# EAGLE design env_sensor_3 (EAGLE 9.7.0)
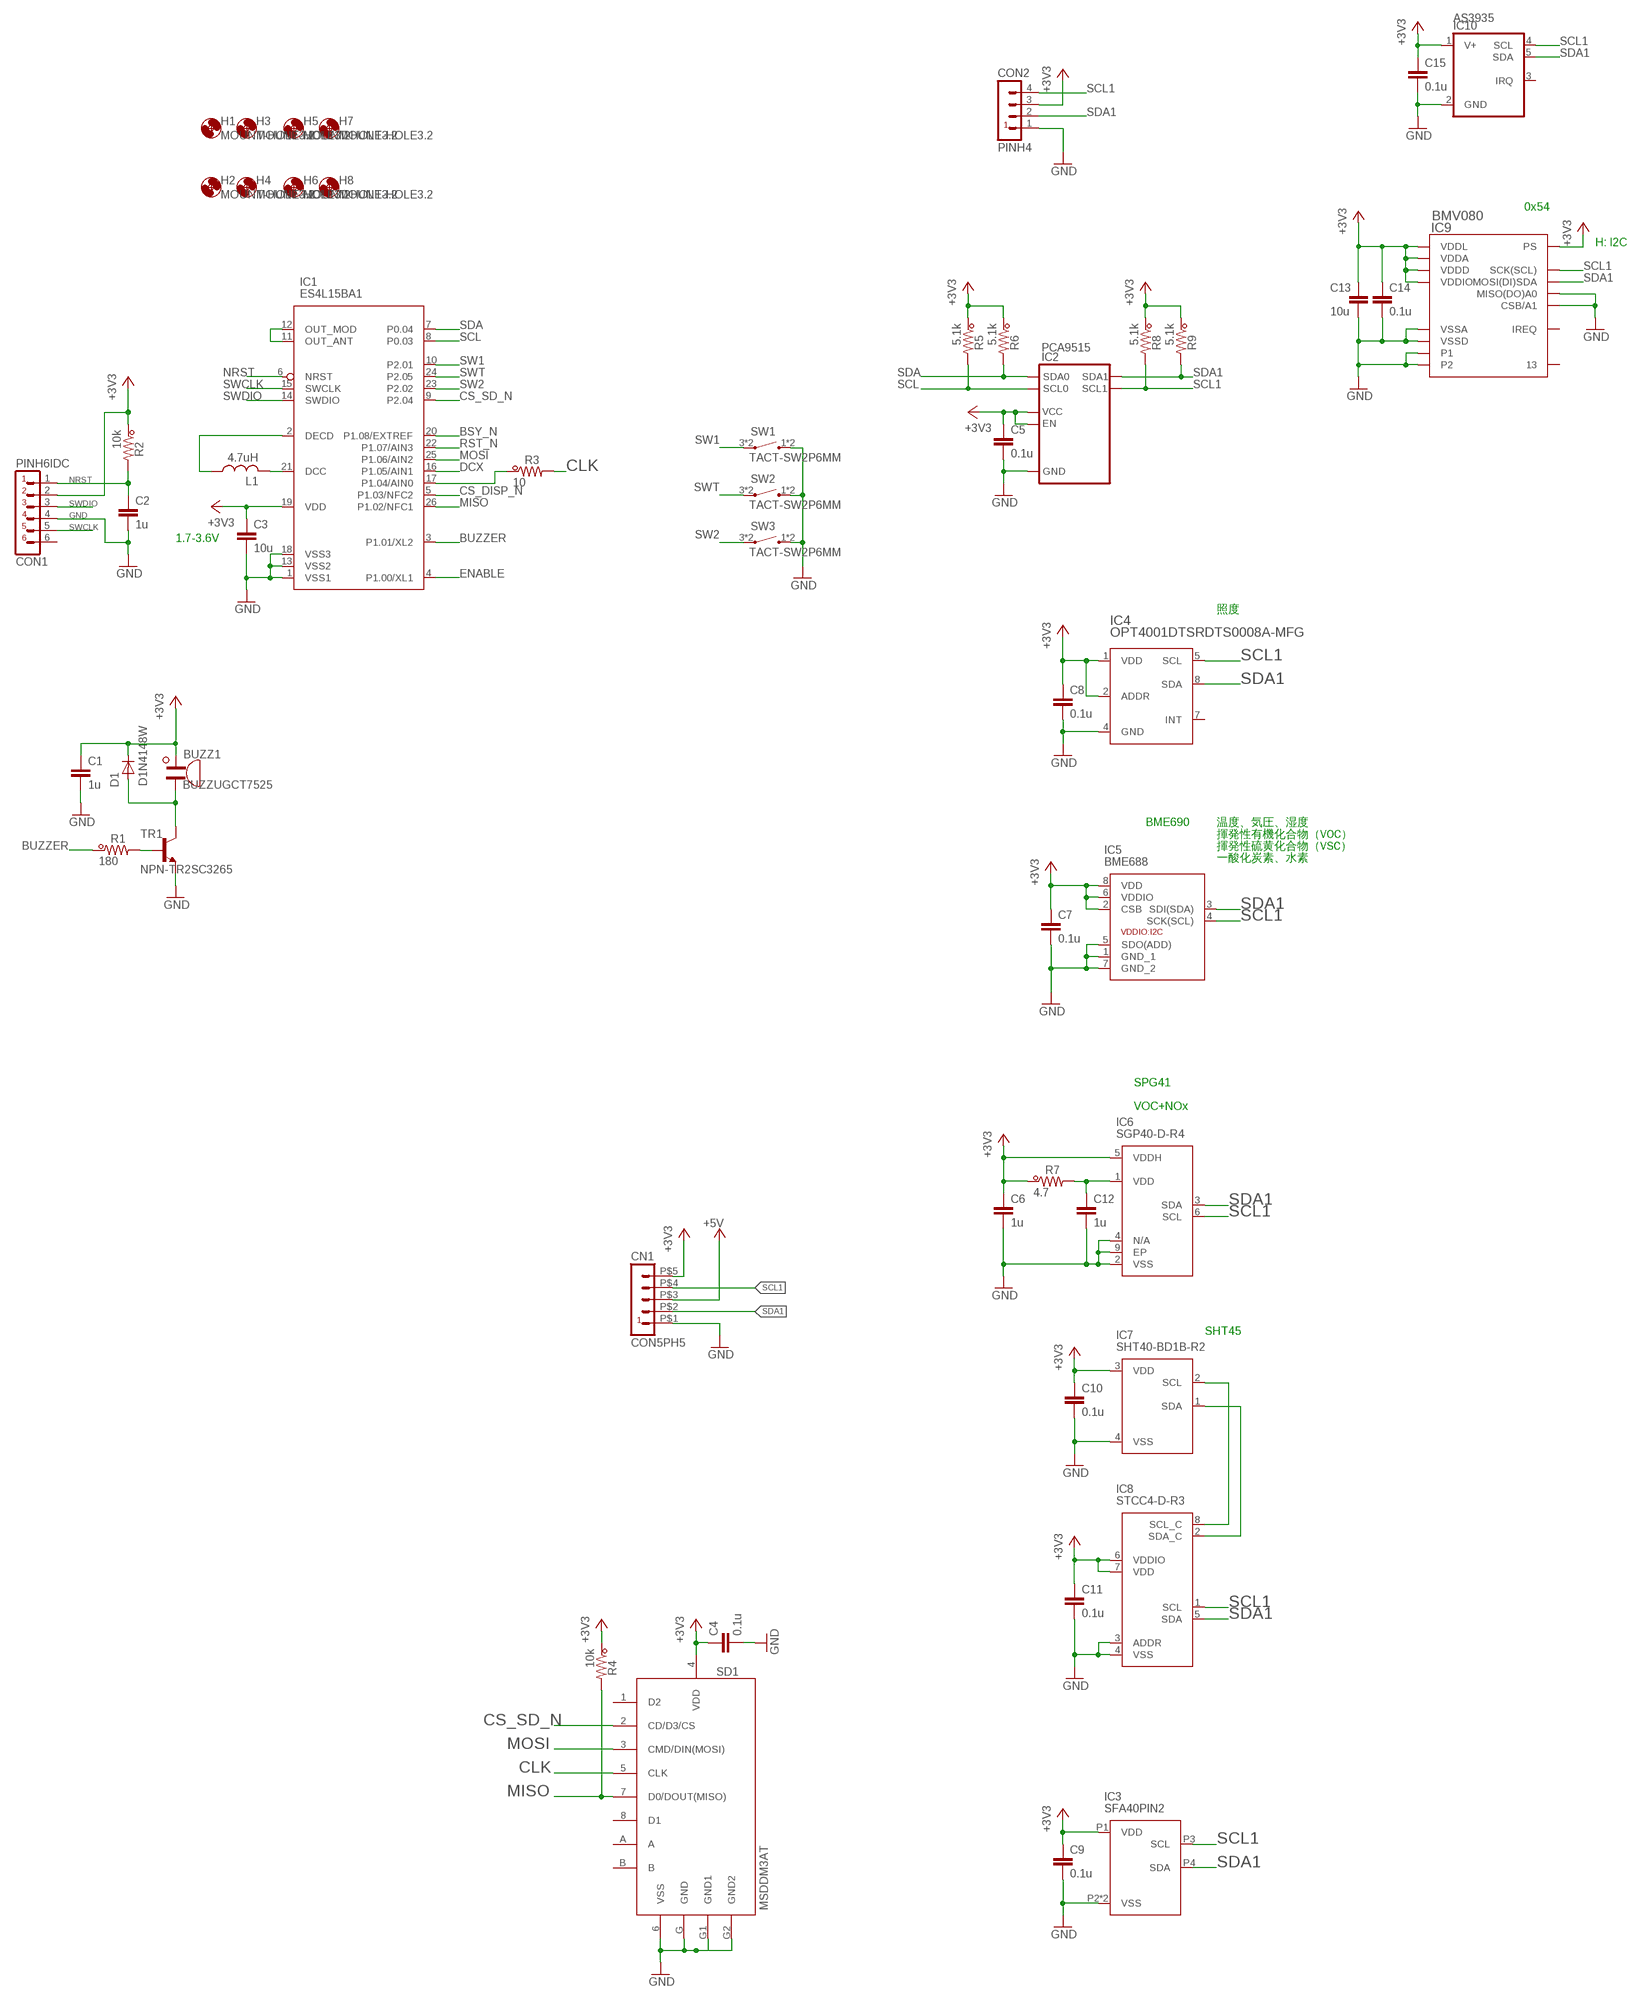
[diagram p0: schematic, sheet 1, part 1 of 2]
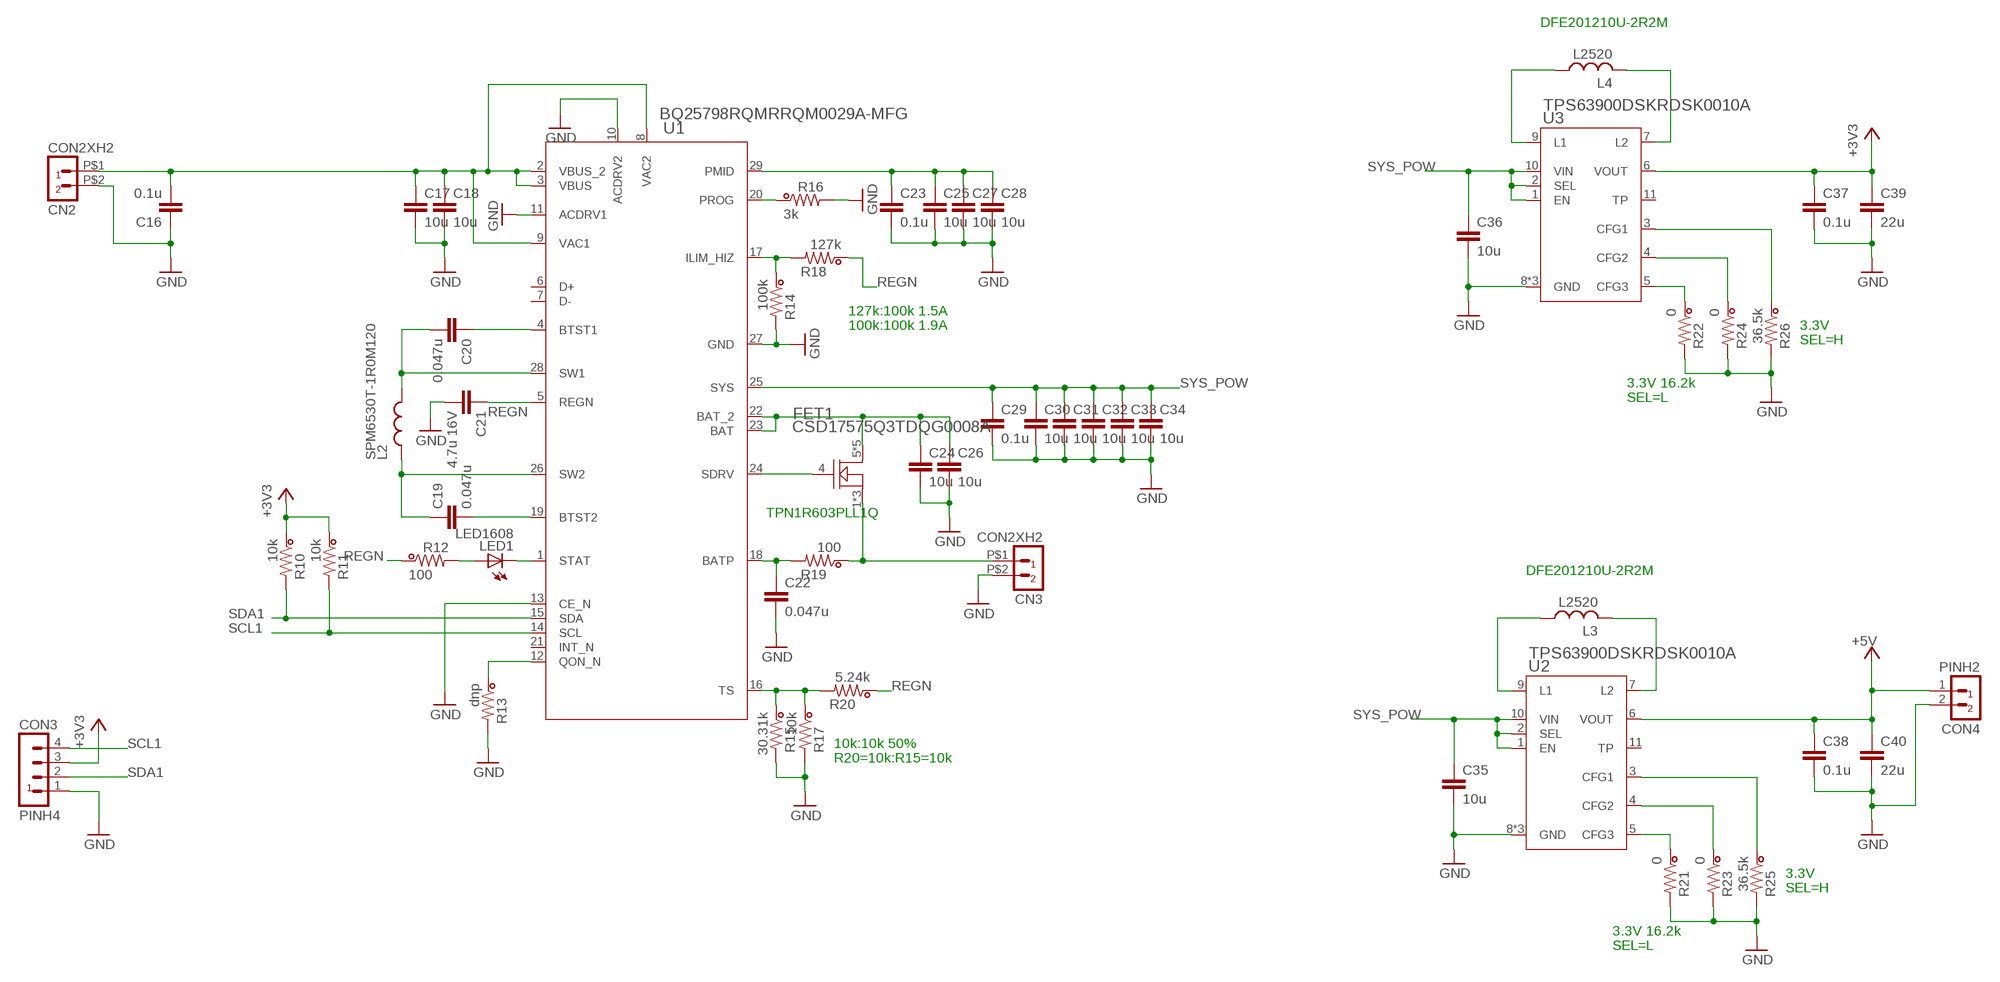
[diagram p1: schematic, sheet 1, part 2 of 2]

## Parts
BUZZ1  BUZZUGCT7525  [UGCT7525]
C1  1u  C-CC1005A  [1005A]
C2  1u  C-CC1005A  [1005A]
C3  10u  C-CC1608A  [1608A]
C4  0.1u  C-CC1005A  [1005A]
C5  0.1u  C-CC1005K  [1005K]
C6  1u  C-CC1005K  [1005K]
C7  0.1u  C-CC1005K  [1005K]
C8  0.1u  C-CC1005K  [1005K]
C9  0.1u  C-CC1005K  [1005K]
C10  0.1u  C-CC1005K  [1005K]
C11  0.1u  C-CC1005K  [1005K]
C12  1u  C-CC1005K  [1005K]
C13  10u  C-CC1005K  [1005K]
C14  0.1u  C-CC1005K  [1005K]
C15  0.1u  C-CC1005K  [1005K]
C16  0.1u  C-CC1005K  [1005K]
C17  10u  C-CC2012A  [2012A]
C18  10u  C-CC2012A  [2012A]
C19  0.047u  C-CC1005K  [1005K]
C20  0.047u  C-CC1005K  [1005K]
C21  4.7u 16V  C-CC1608A  [1608A]
C22  0.047u  C-CC1005K  [1005K]
C23  0.1u  C-CC1005A  [1005A]
C24  10u  C-CC2012A  [2012A]
C25  10u  C-CC2012A  [2012A]
C26  10u  C-CC2012A  [2012A]
C27  10u  C-CC2012A  [2012A]
C28  10u  C-CC2012A  [2012A]
C29  0.1u  C-CC1005A  [1005A]
C30  10u  C-CC2012A  [2012A]
C31  10u  C-CC2012A  [2012A]
C32  10u  C-CC2012A  [2012A]
C33  10u  C-CC2012A  [2012A]
C34  10u  C-CC2012A  [2012A]
C35  10u  C-CC2012A  [2012A]
C36  10u  C-CC2012A  [2012A]
C37  0.1u  C-CC1005A  [1005A]
C38  0.1u  C-CC1005A  [1005A]
C39  22u  C-CC2012A  [2012A]
C40  22u  C-CC2012A  [2012A]
CN1  CON5PH5  [PH5]
CN2  CON2XH2  [XH2]
CN3  CON2XH2  [XH2]
CON1  PINH6IDC  [1X6IDC_1R27]
CON2  PINH4  [PINH4]
CON3  PINH4  [PINH4]
CON4  PINH2  [PINH2]
D1  D1N4148W  [1N4148W]
FET1  CSD17575Q3TDQG0008A  [DQG0008A]
H1  MOUNT-HOLE3.2  [3,2]
H2  MOUNT-HOLE3.2  [3,2]
H3  MOUNT-HOLE3.2  [3,2]
H4  MOUNT-HOLE3.2  [3,2]
H5  MOUNT-HOLE3.2  [3,2]
H6  MOUNT-HOLE3.2  [3,2]
H7  MOUNT-HOLE3.2  [3,2]
H8  MOUNT-HOLE3.2  [3,2]
IC1  ES4L15BA1  [ES4L15BA1]
IC2  PCA9515  [SO8]
IC3  SFA40PIN2  [SFA40-PIN2]
IC4  OPT4001DTSRDTS0008A-MFG  [DTS0008A-MFG]
IC5  BME688  [BME688]
IC6  SGP40-D-R4  [SON80P244X244X95-7N]
IC7  SHT40-BD1B-R2  [SHT40BD1BR2]
IC8  STCC4-D-R3  [STCC4DR3]
IC9  BMV080  [CON_5035661302_MOL]
IC10  AS3935  [AS3935]
L1  4.7uH  L1608  [1608A]
L2  SPM6530T-1R0M120  [IND_SPM6530T-1R0M120]
L3  L2520  [2520]
L4  L2520  [2520]
LED1  LED1608  [LED1608]
R1  180  R-CC1005A  [1005A]
R2  10k  R-CC1005A  [1005A]
R3  10  R-CC1005A  [1005A]
R4  10k  R-CC1005A  [1005A]
R5  5.1k  R-CC1005A  [1005A]
R6  5.1k  R-CC1005A  [1005A]
R7  4.7  R-CC1005A  [1005A]
R8  5.1k  R-CC1005A  [1005A]
R9  5.1k  R-CC1005A  [1005A]
R10  10k  R-CC1005A  [1005A]
R11  10k  R-CC1005A  [1005A]
R12  100  R-CC1005A  [1005A]
R13  dnp  R-CC1608A  [1608A]
R14  100k  R-CC1005A  [1005A]
R15  30.31k  R-CC1005A  [1005A]
R16  3k  R-CC1005A  [1005A]
R17  10k  R-CC2012A  [2012A]
R18  127k  R-CC1005A  [1005A]
R19  100  R-CC1005A  [1005A]
R20  5.24k  R-CC1005A  [1005A]
R21  0  R-CC1005A  [1005A]
R22  0  R-CC1005A  [1005A]
R23  0  R-CC1005A  [1005A]
R24  0  R-CC1005A  [1005A]
R25  36.5k  R-CC1005A  [1005A]
R26  36.5k  R-CC1005A  [1005A]
SD1  MSDDM3AT  [DM3AT]
SW1  TACT-SW2P6MM  [DTS-6-V]
SW2  TACT-SW2P6MM  [DTS-6-V]
SW3  TACT-SW2P6MM  [DTS-6-V]
TR1  NPN-TR2SC3265  [SOT23-3]
U1  BQ25798RQMRRQM0029A-MFG  [RQM0029A-MFG]
U2  TPS63900DSKRDSK0010A  [DSK0010A]
U3  TPS63900DSKRDSK0010A  [DSK0010A]

## Nets
+3V3: BUZZ1.P(+) C1.1 C3.1 C4.1 C5.1 C6.1 C7.1 C8.1 C9.1 C10.1 C11.1 C13.1 C14.1 C15.1 C37.1 C39.1 CN1.P$5 CON1.2 CON2.3 CON3.3 D1.C IC1.19(VDD) IC2.5(EN) IC2.8(VCC) IC3.P1(VDD) IC4.1(VDD) IC4.2(ADDR) IC5.2(CSB) IC5.6(VDDIO) IC5.8(VDD) IC6.5(VDDH) IC7.3(VDD) IC8.6(VDDIO) IC8.7(VDD) IC9.1(VDDL) IC9.3(VDDA) IC9.7(PS) IC9.8(VDDIO) IC9.10(VDDD) IC10.1(V+) R2.1 R4.1 R5.1 R6.1 R7.1 R8.1 R9.1 R10.1 R11.1 SD1.4(VDD) U3.6(VOUT)
+5V: C38.1 C40.1 CN1.P$3 CON4.1 U2.6(VOUT)
BSY_N: IC1.20(P1.08/EXTREF)
BUZZER: IC1.3(P1.01/XL2) R1.1
CLK: R3.2 SD1.5(CLK)
CS_DISP_N: IC1.5(P1.03/NFC2)
CS_SD_N: IC1.9(P2.04) SD1.2(CD/D3/CS)
DCX: IC1.16(P1.05/AIN1)
ENABLE: IC1.4(P1.00/XL1)
GND: C1.2 C2.2 C3.2 C4.2 C5.2 C6.2 C7.2 C8.2 C9.2 C10.2 C11.2 C12.2 C13.2 C14.2 C15.2 C16.1 C17.2 C18.2 C21.2 C22.2 C23.2 C24.2 C25.2 C26.2 C27.2 C28.2 C29.2 C30.2 C31.2 C32.2 C33.2 C34.2 C35.2 C36.2 C37.2 C38.2 C39.2 C40.2 CN1.P$1 CN2.P$2 CN3.P$2 CON1.4 CON2.1 CON3.1 CON4.2 IC1.1(VSS1) IC1.13(VSS2) IC1.18(VSS3) IC2.4(GND) IC3.P2(VSS) IC3.P6(VSS) IC4.4(GND) IC5.1(GND_1) IC5.5(SDO(ADD)) IC5.7(GND_2) IC6.2(VSS) IC6.4(N/A) IC6.9(EP) IC7.4(VSS) IC8.3(ADDR) IC8.4(VSS) IC9.2(VSSA) IC9.4(CSB/A1) IC9.9(VSSD) IC9.11(MISO(DO)A0) IC9.P1 IC9.P2 IC10.2(GND) R13.2 R14.2 R15.2 R16.2 R17.2 R21.2 R22.2 R23.2 R24.2 R25.2 R26.2 SD1.6(VSS) SD1.G1(GND1) SD1.G2(GND2) SD1.G(GND) SW1.1(T1) SW1.2(T1) SW2.1(T1) SW2.2(T1) SW3.1(T1) SW3.2(T1) TR1.2(E) U1.10(ACDRV2) U1.11(ACDRV1) U1.13(CE_N) U1.27(GND) U2.8(GND) U2.V(GND) U2.V_1(GND) U3.8(GND) U3.V(GND) U3.V_1(GND)
MISO: IC1.26(P1.02/NFC1) R4.2 SD1.7(D0/DOUT(MISO))
MOSI: IC1.25(P1.06/AIN2) SD1.3(CMD/DIN(MOSI))
N$1: IC1.17(P1.04/AIN0) R3.1
N$2: R1.2 TR1.1(B)
N$3: R25.1 U2.3(CFG1)
N$4: R26.1 U3.3(CFG1)
N$5: R13.1 U1.12(QON_N)
N$6: R16.1 U1.20(PROG)
N$7: L4.2 U3.7(L2)
N$8: L4.1 U3.9(L1)
N$9: L3.2 U2.7(L2)
N$10: LED1.K(C) U1.1(STAT)
N$11: C20.2 L2.2 U1.28(SW1)
N$12: C19.1 L2.1 U1.26(SW2)
N$13: BUZZ1.N(-) D1.A TR1.3(C)
N$14: C20.1 U1.4(BTST1)
N$15: C19.2 U1.19(BTST2)
N$16: C23.1 C25.1 C27.1 C28.1 U1.29(PMID)
N$17: R14.1 R18.2 U1.17(ILIM_HIZ)
N$18: FET1.4(G) U1.24(SDRV)
N$19: C24.1 C26.1 FET1.5(D) FET1.6(D) FET1.7(D) FET1.8(D) FET1.9(D) U1.22(BAT_2) U1.23(BAT)
N$20: C22.1 R19.2 U1.18(BATP)
N$21: CN3.P$1 FET1.1(S) FET1.2(S) FET1.3(S) R19.1
N$22: R15.1 R17.1 R20.2 U1.16(TS)
N$23: LED1.A R12.2
N$24: R24.1 U3.4(CFG2)
N$25: R22.1 U3.5(CFG3)
N$26: C16.2 C17.1 C18.1 CN2.P$1 U1.2(VBUS_2) U1.3(VBUS) U1.8(VAC2) U1.9(VAC1)
N$27: L3.1 U2.9(L1)
N$28: C12.1 IC6.1(VDD) R7.2
N$29: R23.1 U2.4(CFG2)
N$30: R21.1 U2.5(CFG3)
N$51: IC1.21(DCC) L1.2
N$53: IC7.2(SCL) IC8.8(SCL_C)
N$55: IC7.1(SDA) IC8.2(SDA_C)
N$61: IC1.2(DECD) L1.1
N$63: IC1.11(OUT_ANT) IC1.12(OUT_MOD)
NRST: C2.1 CON1.1 IC1.6(NRST) R2.2
REGN: C21.1 R12.1 R18.1 R20.1 U1.5(REGN)
RST_N: IC1.22(P1.07/AIN3)
SCL: IC1.8(P0.03) IC2.2(SCL0) R5.2
SCL1: CN1.P$4 CON2.4 CON3.4 IC2.7(SCL1) IC3.P3(SCL) IC4.5(SCL) IC5.4(SCK(SCL)) IC6.6(SCL) IC8.1(SCL) IC9.6(SCK(SCL)) IC10.4(SCL) R8.2 R11.2 U1.14(SCL)
SDA: IC1.7(P0.04) IC2.3(SDA0) R6.2
SDA1: CN1.P$2 CON2.2 CON3.2 IC2.6(SDA1) IC3.P4(SDA) IC4.8(SDA) IC5.3(SDI(SDA)) IC6.3(SDA) IC8.5(SDA) IC9.5(MOSI(DI)SDA) IC10.5(SDA) R9.2 R10.2 U1.15(SDA)
SW1: IC1.10(P2.01) SW1.3(T2) SW1.4(T2)
SW2: IC1.23(P2.02) SW3.3(T2) SW3.4(T2)
SWCLK: CON1.5 IC1.15(SWCLK)
SWDIO: CON1.3 IC1.14(SWDIO)
SWT: IC1.24(P2.05) SW2.3(T2) SW2.4(T2)
SYS_POW: C29.1 C30.1 C31.1 C32.1 C33.1 C34.1 C35.1 C36.1 U1.25(SYS) U2.1(EN) U2.2(SEL) U2.10(VIN) U3.1(EN) U3.2(SEL) U3.10(VIN)
Unconnected: CON1.6 IC4.7(INT) IC9.12(IREQ) IC9.13 IC10.3(IRQ) SD1.1(D2) SD1.8(D1) SD1.A SD1.B U1.6(D+) U1.7(D-) U1.21(INT_N) U2.11(TP) U3.11(TP)

## Notes on the sheet
- 0x54
- H: I2C
- 1.7-3.6V
- 照度
- DFE201210U-2R2M
- BME690 | 温度、気圧、湿度
- 揮発性有機化合物（VOC）
- 揮発性硫黄化合物（VSC）
- 一酸化炭素、水素
- 127k:100k 1.5A
- 100k:100k 1.9A | 3.3V
- SEL=H
- SPG41 | 3.3V 16.2k
- SEL=L
- VOC+NOx
- TPN1R603PLL1Q
- DFE201210U-2R2M
- SHT45
- 10k:10k 50%
- R20=10k:R15=10k
- 3.3V
- SEL=H
- 3.3V 16.2k
- SEL=L

## Library data of the parts
BUZZ1 = dac:BUZZ; SHOP: AKI
C1-C40 = dac:C-CC
CN1 = dac:CON5
CN2 CN3 = dac:CON2
CON1 = dac:PINH6
CON2 CON3 = dac:PINH4
CON4 = dac:PINH2
D1 = dac:D
FET1 = SamacSys_Parts:CSD17575Q3T; PARTS: TPN1R603PLL1Q; SHOP: aki
H1-H8 = holes:MOUNT-HOLE: MOUNTING HOLE with drill center marker
IC1 = SamacSys_Parts:ES4L15BA1: Board Mount Motion & Position Sensors 9-axis IMU Source: Datasheet <https://www.ceva-dsp.com/wp-content/uploads/2019/10/BNO080_085-Datasheet.pdf>
IC2 = dac:PCA9515; SHOP: AKI
IC3 = SamacSys_Parts:SFA40
IC4 = SamacSys_Parts:OPT4001DTSR
IC5 = SamacSys_Parts:BME688: Gas sensor measuring relative humidity, barometric pressure, ambient temperature and gas (VOC) Source: Datasheet <https://www.bosch-sensortec.com/media/boschsensortec/downloads/datasheets/bst-bme688-ds000.pdf>; PARTS: bme690
IC6 = SamacSys_Parts:SGP40-D-R4: Air Quality Sensors Gas Sensor 2.5k pcs IC Source: Datasheet; PARTS: spg41
IC7 = SamacSys_Parts:SHT40-BD1B-R2: SENSIRION - SHT40-BD1B-R2 - Humidity and Temperature Sensor, Digital, 0% to 100% RH, I2C, DFN-EP-4, -40C to 125C Source: Datasheet <https://sensirion.com/media/documents/33FD6951/63E1087C/Datasheet_SHT4x_1.pdf>; PARTS: SHT4x-Axx
IC8 = SamacSys_Parts:STCC4-D-R3: Air Quality Sensors STCC4-D-R3 CO2 I2C, SMD ToR 1500 pcs 2.7V ~ 5.5V 950A 10C ~ 40C Source: Datasheet <https://sensirion.com/media/documents/6AED4B15/684A889C/CD_DS_STCC4_D1_3.pdf>
IC9 = SamacSys_Parts:BMV080
IC10 = dac:AS3935; SHOP: AKI
L1 = dac:L; PARTS: LSQPB160807T4R7M; SHOP: mouser
L2 = SamacSys_Parts:SPM6530T-1R0M120
L3 L4 = dac:L; PARTS: DFE201210U-2R2M
LED1 = dac:LED: LED rectangle, 5.7 x 3.2 mm
R1-R26 = dac:R-CC
SD1 = dac:MSD
SW1-SW3 = dac:TACT-SW2P
TR1 = dac:NPN-TR; SHOP: AKI
U1 = SamacSys_Parts:BQ25798RQMR
U2 U3 = SamacSys_Parts:TPS63900DSKR

## Board
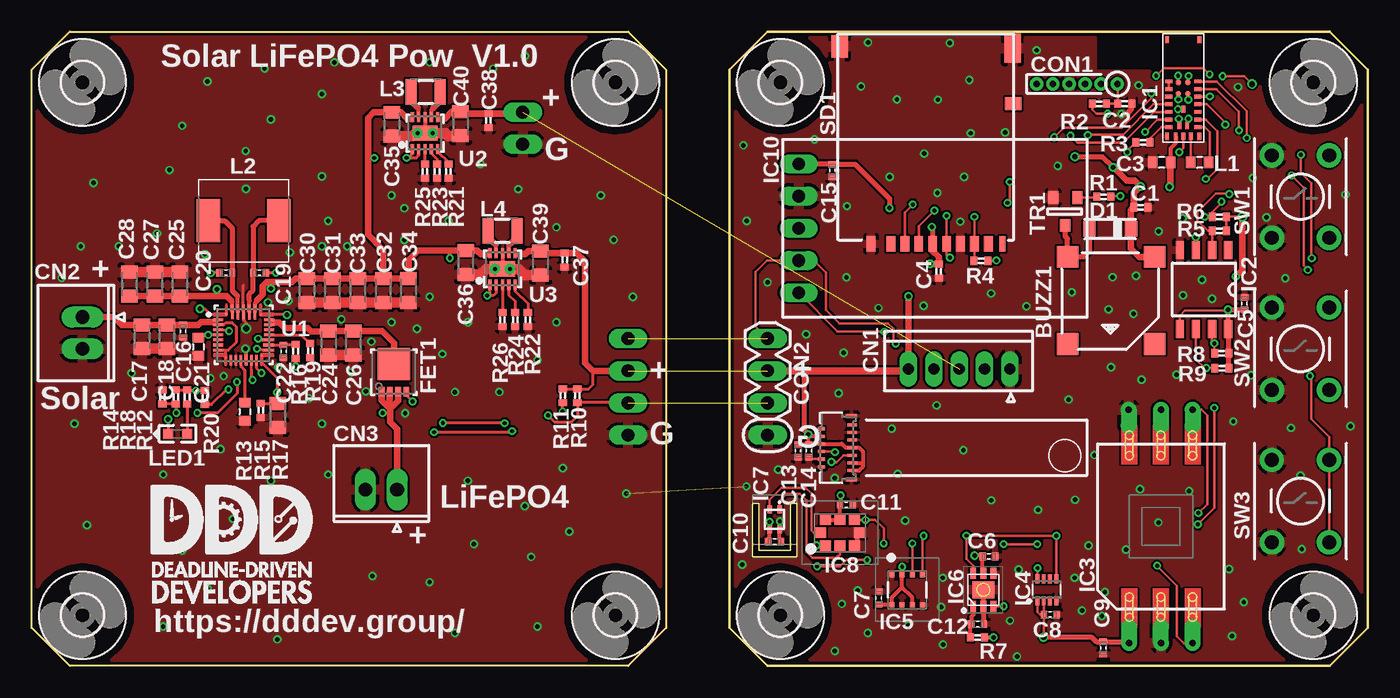
[diagram p2: board, top side]
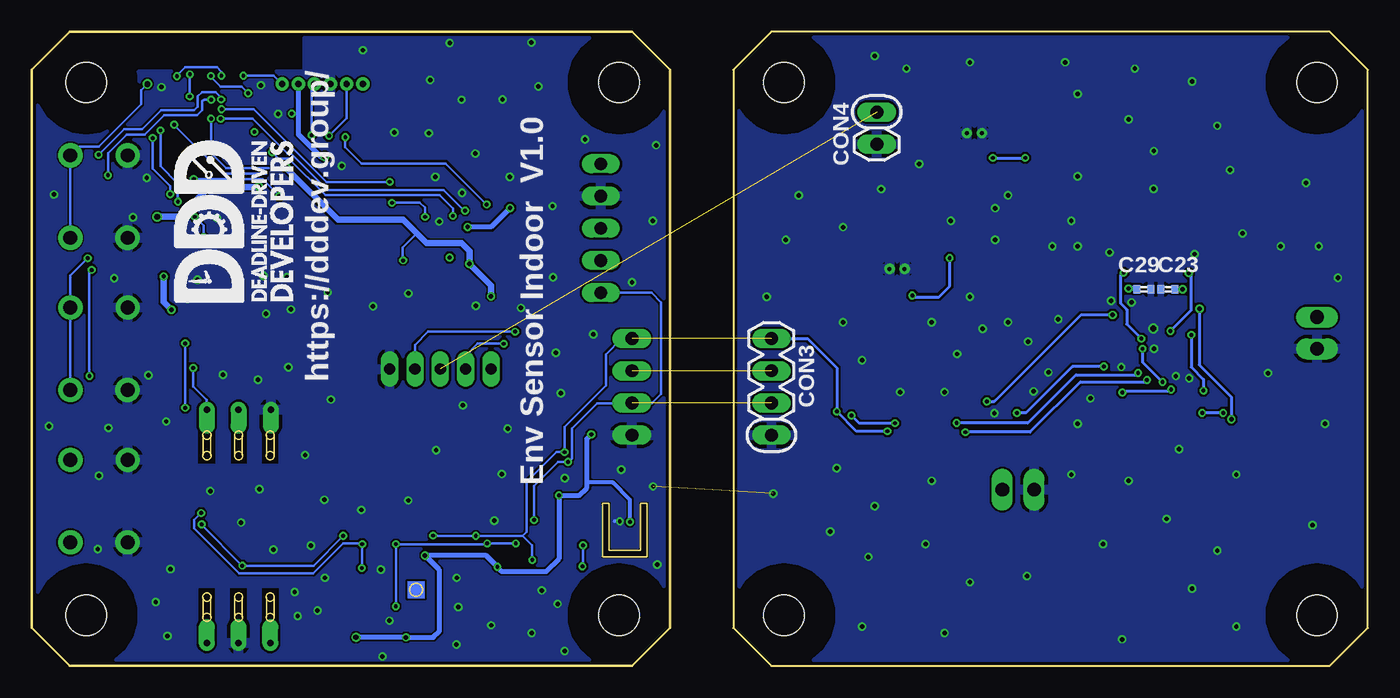
[diagram p3: board, bottom side, seen from below]

Size 105.3 x 50 mm. Coordinates in mm from the lower left corner, seen from the top.
Outline: 55,47 55,3 58,0 102.3,0 105.3,3 105.3,47 102.3,50 58,50 55,47
Outline: 47,0 3,0 0,3 0,47 3,50 47,50 50,47 50,3 47,0
Copper layers (1*16): Top / Bottom
Stack-up Default Layer Stack: Top User Defined 0.035mm / Dielectric-1 User Defined 1.5mm / Bottom User Defined 0.035mm
Design rules: minimum drill size 12mil, copper clearance wire_polygon to wire_polygon 6mil, copper clearance wire_polygon to pad_smd 6mil, copper clearance wire_polygon to via 6mil, copper clearance pad_smd to pad_smd 6mil, copper clearance pad_smd to via 6mil, copper clearance via to via 6mil, copper clearance smd to pad (same net) 0mil, copper clearance smd to via (same net) 0mil, copper clearance smd to smd (same net) 0mil, dimension clearance 10mil, via restrict clearance 0mil, drill distance 10mil, keepout clearance 0mil
RestrictCopper: area 84,47 to 97.5,50; area 83.9,47 to 97.5,50; area 85.9,16 to 87.1,18.6; area 88.3,16 to 89.6,18.6; area 90.9,16 to 92.2,18.6; area 90.9,3.6 to 92.1,6.1; area 88.4,3.6 to 89.7,6.1; area 85.8,3.6 to 87.2,6.1; area 56.7,8.5 to 60.4,12.9; area 56.7,8.5 to 60.4,12.9; 1 lines
Milling: 8 lines

### Footprints (pad centres in the part's own frame; a part is rotated, then mirrored left to right if it is on the bottom)
UGCT7525 = smd 1.7 x 1.7: N -3.493,-3.373; P -3.493,3.493; P$3 3.373,-3.373; P$4 3.373,3.493
1005A = smd 0.55 x 0.65: 1 -0.55,0; 2 0.55,0
1608A = smd 0.75 x 0.9: 1 -0.7,0; 2 0.7,0
1005K = smd 0.5 x 0.6: 1 -0.5,0; 2 0.5,0
2012A = smd 1.016 x 1.3: 1 -0.94,0; 2 0.94,0
PH5 = drill 0.889 long: P$1 4,0; P$2 2,0; P$3 0,0; P$4 -2,0; P$5 -4,0
XH2 = drill 1.092 long: P$1 2.5,0; P$2 0,0
1X6IDC_1R27 = drill 0.5 pad 1.05: 1 -3.81,0; 2 -2.54,0; 3 -1.27,0; 4 0,0; 5 1.27,0; 6 2.54,0
PINH4 = drill 1.016 long: 1 -3.81,0; 2 -1.27,0; 3 1.27,0; 4 3.81,0
PINH2 = drill 1.016 long: 1 -1.27,0; 2 1.27,0
1N4148W = smd 0.97 x 1.22: A 1.64,0; C -1.64,0
DQG0008A = smd 0.75 x 0.44: 1 -1.525,0.975; 2 -1.525,0.325; 3 -1.525,-0.325; 4 -1.525,-0.975; 5 1.525,-0.975; 6 1.525,-0.325; 7 1.525,0.325; 8 1.525,0.975 | smd 2.5 x 2.55: 9 0.65,0
3,2 = hole 3.2: 0,0
ES4L15BA1 = smd 0.55 x 0.3: 1 -3.8,-1.275; 18 -3.8,1.275; 19 -3.8,0.6; 20 -3.8,0; 21 -3.8,-0.6; 22 -2.95,-0.3; 25 -2.95,0.3; 26 -1.675,0; 27 3.8,-1.275; 28 3.8,1.275 | smd 0.3 x 0.55: 2 -3.075,-1.15; 3 -2.475,-1.15; 4 -1.875,-1.15; 5 -1.275,-1.15; 6 -0.675,-1.15; 7 -0.075,-1.15; 8 0.525,-1.15; 11 0.525,1.15; 12 -0.075,1.15; 13 -0.675,1.15; 14 -1.275,1.15; 15 -1.875,1.15; 16 -2.475,1.15; 17 -3.075,1.15 | smd 0.45 x 0.45: 9 0.45,-0.375; 10 0.45,0.375; 23 -0.45,-0.375; 24 -0.45,0.375
SO8 = smd 0.65 x 1.4: 1 -1.905,-3.115; 2 -0.635,-3.115; 3 0.635,-3.115; 4 1.905,-3.115; 5 1.905,3.115; 6 0.635,3.115; 7 -0.635,3.115; 8 -1.905,3.115
SFA40-PIN2 = drill 0.5 pad 1.27 offset: P1 -9.2,2.5; P2 -9.2,0; P3 -9.2,-2.5; P4 9.2,-2.5; P5 9.2,0; P6 9.2,2.54
DTS0008A-MFG = smd 0.72 x 0.3: 1 -0.86,0.75; 2 -0.86,0.25; 3 -0.86,-0.25; 4 -0.86,-0.75; 5 0.86,-0.75; 6 0.86,-0.25; 7 0.86,0.25; 8 0.86,0.75
BME688 = smd 0.4 x 0.4: 1 1.2,1.2; 2 1.2,0.4; 3 1.2,-0.4; 4 1.2,-1.2; 5 -1.2,-1.2; 6 -1.2,-0.4; 7 -1.2,0.4; 8 -1.2,1.2
SON80P244X244X95-7N = smd 0.85 x 0.45: 1 -1.3,0.8; 2 -1.3,0; 3 -1.3,-0.8; 4 1.3,-0.8; 5 1.3,0; 6 1.3,0.8 | smd 1.35 x 1.73: 9 0,0
SHT40BD1BR2 = smd 0.62 x 0.35: 1 -0.79,0.4; 2 -0.79,-0.4; 3 0.79,-0.4; 4 0.79,0.4
STCC4DR3 = smd 0.85 x 0.85: 1 -1.025,1.15; 2 -1.025,0; 3 -1.025,-1.15; 4 0,-1.525; 5 1.025,-1.15; 6 1.025,0; 7 1.025,1.15; 8 0,1.525
CON_5035661302_MOL = smd 0.25 x 0.72: 1 -1.795,-1.12; 3 -1.195,-1.12; 5 -0.595,-1.12; 7 0.005,-1.12; 9 0.605,-1.12; 11 1.205,-1.12; 13 1.805,-1.12 | smd 0.25 x 0.52: 2 -1.5,1.31; 4 -0.9,1.31; 6 -0.3,1.31; 8 0.3,1.31; 10 0.9,1.31; 12 1.5,1.31 | smd 0.3 x 0.85: P1 -2.505,-1.054; P2 2.515,-1.054
AS3935 = drill 1 long: 1 -5.08,0; 2 -2.54,0; 3 0,0; 4 2.54,0; 5 5.08,0
IND_SPM6530T-1R0M120 = smd 1.85 x 3.4: 1 -2.775,0; 2 2.775,0
2520 = smd 0.87 x 2: 1 -1.15,0; 2 1.15,0
LED1608 = smd 0.8 x 0.8: A -0.75,0; K 0.75,0
DM3AT = smd 1.2 x 0.7: 1 -5.046,7.7; 2 -5.046,6.6; 3 -5.046,5.5; 4 -5.046,4.4; 5 -5.046,3.3; 6 -5.046,2.2; 7 -5.046,1.1; 8 -5.046,0; G -5.046,9.25 | smd 1.2 x 0.5: A -5.046,-1.1 | smd 1 x 1.3: B 6,-1.96 | smd 1.778 x 1.3: G1 10.507,11.737 | smd 2.286 x 1.3: G2 10.358,-1.893
DTS-6-V = drill 1.1 pad 1.905: 1 -3.25,2.25; 2 3.25,2.265; 3 -3.25,-2.25; 4 3.25,-2.25
SOT23-3 = smd 0.8 x 1: 1 -0.95,-1.1; 2 0.95,-1.1; 3 0,1.08
RQM0029A-MFG = smd 0.192 x 0.192: 1 -1.369,1.631 | smd 0.8 x 0.2: 2 -2,1.2; 3 -2,0.8; 4 -2,0.4; 5 -2,0; 6 -2,-0.4; 7 -2,-0.8; 8 -2,-1.2; 20 2,0; 21 2,0.4; 22 2,0.8; 23 2,1.2 | smd 0.158 x 0.158: 9 -1.413,-1.762 | smd 0.2 x 0.8: 10 -1,-2; 11 -0.6,-2; 12 -0.2,-2; 13 0.2,-2; 14 0.6,-2; 15 1,-2 | smd 0.175 x 0.175: 16 1.431,-1.631; 24 1.381,1.631 | smd 0.9 x 0.2: 17 1.95,-1.2 | smd 0.85 x 0.2: 18 1.975,-0.8 | smd 0.88 x 0.2: 19 1.96,-0.4 | smd 0.2 x 1.2: 25 0.9,1.8; 26 0.45,1.8; 27 0,1.8; 28 -0.45,1.8 | smd 0.2 x 1.15: 29 -0.9,1.825
DSK0010A = smd 0.8 x 0.25: 1 -1.25,1; 2 -1.25,0.5; 3 -1.25,0; 4 -1.25,-0.5; 5 -1.25,-1; 6 1.25,-1; 7 1.25,-0.5; 8 1.25,0; 9 1.25,0.5; 10 1.25,1 | smd 1.2 x 2: 11 0,0 | drill 0.305: V 0,0.59; V_1 0,-0.59

### Placement (x,y rotation side)
BUZZ1  85,28.75 270 top
C1  87.4,36.15 0 top
C2  86.14,44.33 0 top
C3  89.05,39.7 180 top
C4  71.49,31.12 270 top
C5  95.58,28.57 90 top
C6  75.44,8.64 0 top
C7  66.75,5.35 90 top
C8  80.27,4.05 0 top
C9  84.45,1.41 270 top
C10  58.55,9.8 0 top
C11  64.2,12.7 0 top
C12  74.55,3.3 0 top
C13  60.4,16.95 270 top
C14  61.25,16.95 270 top
C15  63.1,39.05 270 top
C16  11.94,26.39 90 top
C17  8.7,25.95 270 top
C18  10.65,25.95 270 top
C19  17.95,31 0 top
C20  15.3,31 0 top
C21  13.13,25.16 270 top
C22  19.85,24.8 270 top
C23  15.75,29.7 180 bottom
C24  23.4,25.45 270 top
C25  11.7,30.1 90 top
C26  25.35,25.45 270 top
C27  9.7,30.1 90 top
C28  7.7,30.1 90 top
C29  17.65,29.7 0 bottom
C30  21.7,29.6 270 top
C31  23.7,29.6 270 top
C32  27.7,29.6 270 top
C33  25.7,29.6 270 top
C34  29.7,29.6 270 top
C35  28.4,42.7 270 top
C36  34.2,31.8 270 top
C37  42,32 270 top
C38  36,43 270 top
C39  40.1,31.75 270 top
C40  33.8,42.75 270 top
CN1  73.1,23.4 0 top
CN2  4,25 90 top
CN3  26.3,13.9 0 top
CON1  81.75,45.88 180 top
CON2  58,22 90 top
CON3  47,22 90 bottom
CON4  38.7,42.4 270 bottom
D1  85,34.45 180 top
FET1  28.55,23.15 90 top
H1  4,4 0 top
H2  59,46 0 top
H3  4,46 0 top
H4  101,4 0 top
H5  46,46 0 top
H6  101,46 0 top
H7  46,4 0 top
H8  59,4 0 top
IC1  90.76,45.55 90 top
IC2  92.39,29.67 180 top
IC3  89,11 90 top
IC4  80,6 90 top
IC5  69,6 90 top
IC6  75,6 90 top
IC7  58.55,11.55 270 top
IC8  63.7,10.5 90 top
IC9  63.55,17.2 90 top
IC10  60.45,34.5 270 top
L1  92.05,39.7 180 top
L2  16.7,35.1 180 top
L3  31.05,45.25 0 top
L4  37.1,34.3 0 top
LED1  11.5,18.3 180 top
R1  84.49,36.99 180 top
R2  84.13,44.32 0 top
R3  87.58,41.28 180 top
R4  74.82,31.93 180 top
R5  93.6,34.31 180 top
R6  93.6,35.41 180 top
R7  74.55,2.25 180 top
R8  93.79,24.65 180 top
R9  93.81,23.46 180 top
R10  43,21.3 270 top
R11  41.85,21.3 270 top
R12  12.25,21.2 270 top
R13  16.8,20.05 270 top
R14  10.3,21.2 90 top
R15  18.05,20.15 270 top
R16  21.95,24.85 270 top
R17  19.4,19.75 270 top
R18  11.35,21.2 270 top
R19  20.8,24.8 90 top
R20  13.65,21.15 270 top
R21  32.85,39 270 top
R22  39.1,27.3 270 top
R23  31.95,39 270 top
R24  38.1,27.3 270 top
R25  31,39 270 top
R26  37.1,27.3 270 top
SD1  75.41,38.33 90 top
SW1  100,37 90 top
SW2  100,25 90 top
SW3  100,13 90 top
TR1  81.45,35.82 180 top
U1  16.7,26.1 0 top
U2  31,42 90 top
U3  37.1,31.3 90 top

### Tracks (layer width: path | path; a pad name or v marks a point on that pad's centre or on a via)
+3V3  (via drill 0.3, 0.35, 0.4, 0.45)  (1 unrouted)
  Top 0.2: 79.75,4.07 C8.1 | R4.1 75.99,31.93 v76.03,31.97 | 95.66,28.15 C5.1 | IC2.5 90.48,27.59 90.9,28 94.21,28 v94.3,28.09 | R2.1 83.58,43.87 83.92,43.53 v84.8,43.53 | v79.75,2.25 79.73,2.27 79.77,2.31 C8.1 | C8.1 79.77,5.12 IC4.2 | C8.1 79.45,4.05 79.25,4.25 IC4.1 | R5.1 R6.1 v95.41,35.41
  Top 0.254: R11.1 R10.1 43.9,21.85 44.23,22.18 44.23,23.27
  Top 0.305: IC1.19 90.16,41.21 89.75,40.8 C3.1 | IC5.6 69.4,5.4 68.6,6.2 | 68.6,6.2 IC5.2 v68.6,7.8 | 68.6,6.2 67.8,5.4 IC5.8 66.8,4.8 C7.1 | IC6.5 74.94,7.36 C6.1 | v63.75,13.45 63.75,12.75 C11.1 IC8.6 IC8.7 62.52,11.55 | v74.3,8.7 74.34,8.74 74.84,8.74 | R7.1 v75.8,2.25 | C14.1 61.2,17.5 61.2,18.2 | 61.2,18.2 v61.2,18.25 | C13.1 C14.1 | C14.1 61.3,17.5 IC9.8 63.85,17.5 64.15,17.2 IC9.7 65.19,17.2 65.5,16.9 65.5,16 | IC9.10 61.3,18.1 61.2,18.2 | 65.5,16 65.5,15.7 65.2,15.4 IC9.1 | IC9.3 65.5,16.01 65.5,16 | C10.1 58.15,9.9 IC7.3 v58.15,11.35 | U3.6 38.25,32.45
  Top 0.406: R9.1 94.34,23.48 R8.1 94.34,26.51 IC2.8 v94.3,28.09 94.31,28.07 C5.1 | v82.22,40.14 84.36,40.14 85.19,39.31 v85.24,39.31 | v79.75,2.25 83.56,2.25 83.9,1.91 C9.1 86.39,1.91 IC3.P1 | IC10.1 63.07,39.58 C15.1 64.9,39.55 67.6,36.85 v67.6,36.1 | v70.95,34.6 71.01,34.54 SD1.4 | v61.2,18.25 60.9,18.55 60.9,23.27
  Top 0.508: D1.C 86.64,34.35 | v89.67,37.76 89.75,37.84 C3.1 | 70.99,33.3 SD1.4 71.01,32.69 71.48,32.22 C4.1 | C4.1 71.21,31.67 70.82,31.68 v70.8,31.7 | v85.24,39.31 86.3,38.25 86.94,38.25 v87.39,37.8 86.85,37.26 C1.1 86.64,35.94 D1.C | v95.41,35.41 95.41,31.21 v94.9,30.7 | D1.C 86.64,32.91 87.31,32.24 BUZZ1.P | CN1.P$5 v69.1,29.15 | 38.25,32.45 38.9,32.45 39.14,32.69 C39.1 40.24,32.55 C37.1 42.95,32.55 43.6,31.9 43.6,23.9 44.23,23.27 CON3.3
  Top 0.61: CON2.3 60.9,23.27 68.97,23.27 CN1.P$5
  Bottom 0.2: v76.03,31.97 76.07,32.01 76.07,33 75.06,34.02 75.06,34.22 | 84.3,43.53 84.29,43.54 84.3,43.53 | 84.3,43.53 v84.8,43.53 84.3,43.53
  Bottom 0.305: v58.15,11.35 58.15,13.1 59.5,14.45 61.55,14.45
  Bottom 0.406: CON1.2 84.29,43.54 84.29,41.91 82.52,40.14 v82.22,40.14 | v79.75,2.25 v75.8,2.25 73.65,2.25 73.2,2.7 73.2,7.6 v74.3,8.7 69.5,8.7 v68.6,7.8 68.25,7.45 64.75,7.45 63.75,8.45 v63.75,13.45 62.15,13.45 61.55,14.05 61.55,14.45 61.55,17.9 v61.2,18.25 | v67.6,36.1 69.1,34.6 v70.95,34.6
  Bottom 0.508: v87.39,37.8 87.43,37.76 v89.67,37.76 91.32,37.76 93.67,35.41 v95.41,35.41 | v85.24,39.31 85.24,39.24 81.17,35.17 76.01,35.17 75.06,34.22 74.18,33.34 71.43,33.34 70.8,32.71 v70.8,31.7 69.1,30 v69.1,29.15 | v94.9,30.7 94.9,28.69 v94.3,28.09
+5V  (1 unrouted)
  Top 0.305: U2.6 32.15,43.15
  Top 0.508: C40.1 33.1,43.69 32.56,43.15 32.15,43.15 | 33.82,43.67 C40.1 | C40.1 33.94,43.55 C38.1 38.58,43.55 CON4.1
BSY_N  (via drill 0.3)
  Top 0.2: IC1.20 90.76,40.81 v90.45,40.5
BUZZER  (via drill 0.3)
  Top 0.2: IC1.3 92.53,43.08 93.46,42.15 93.46,39.15 92.71,38.4 v92.53,38.4 | R1.1 85.09,37.04 v85.8,37.04
  Bottom 0.2: v92.53,38.4 92.51,38.38 87.11,38.38 85.8,37.07 v85.8,37.04
CLK  (via drill 0.3)
  Top 0.2: R3.2 87.01,41.28 86.35,40.62 v86.35,40.51 | SD1.5 72.34,33.51 | SD1.5 v72.11,35.48 | SD1.5 72.11,32.44 v72.36,32.19
  Bottom 0.2: v86.35,40.51 85.84,40 85.04,40 82.15,37.11 73.17,37.11 72.11,36.05 v72.11,35.48
CS_DISP_N  (via drill 0.3)
  Top 0.2: IC1.5 92.61,44.27 94.07,42.82 v94.07,42.68
  Bottom 0.2: v94.07,42.68 94.07,42.65 90.22,38.8 86.81,38.8
CS_SD_N  (via drill 0.3, 0.3 pad 0.4)
  Top 0.2: IC1.9 91.13,46.38 91.22,46.47 v91.18,46.51 | v88.25,45.16 88.25,44.77 85.92,42.44 81.33,42.44 v80.58,41.69 | v69.44,36.38 68.81,35.75 SD1.2
  Bottom 0.2: v91.18,46.51 91.18,46.44 90.41,45.67 88.76,45.67 v88.25,45.16 | v69.44,36.38 v69.45,36.38 72.68,39.61 79.29,39.61 80.58,40.9 v80.58,41.69
DCX  (via drill 0.3)
  Top 0.2: IC1.16 88.72,43.08 v87.75,42.1
GND  (via drill 0.3, 0.35, 0.45)  (1 unrouted)
  Top 0.2: IC9.4 61.4,16.3 C14.2
  Top 0.254: v16.9,26.6 16.9,27.05 16.7,27.25 U1.27 16.68,27.92 16.68,29.99
  Top 0.305: v85.88,43.51 86.27,43.51 | C10.2 58.95,9.9 IC7.4 v58.95,11.4 | U1.13 16.9,24.95 v16.85,25 | U3.8 37.1,31.35 | U2.8 31,42.2
  Top 0.406: 65.02,10.29 65.02,9.64 IC8.3 | IC6.9 IC6.2 75,3.35 C12.2 | 86.27,43.51 86.69,43.94 C2.2
  Top 0.813: 31.75,42 32.6,42 32.82,41.78 33.77,41.78 C40.2 | 30.25,42 30.01,41.76 C35.2 | 37.85,31.3 38.37,31.3 38.86,30.81 C39.2 | 36.35,31.3 35.79,31.3 35.35,30.86 C36.2 | C30.2 C31.2 C33.2 C32.2 C34.2 | C24.2 C26.2 | C28.2 C27.2 C25.2 | C17.2 C18.2
  Bottom 0.305: v58.95,11.4 59.35,11.4
  other vias: 64.25,36.25 73.9,46.19 74,42 65.1,5.95 65.9,2.6 82.24,13.09 68.85,11.45 100,15 86.26,9.16 94.6,2.36 73.43,17 65.36,45.68 68.19,44.65 56.36,35.09 90.75,29.22 79.2,48.54 76.73,42.07 95.07,45.63 96.24,38.47 67.63,38.56 66.74,28.22 64.21,30.64 70.33,40.39 63.29,14.81 68.24,15.13 97.33,35.36 83.3,9.48 77.1,3.56 90.7,35.3 71.81,6.94 71.67,4.63 63.85,4.89 65.91,49.14 72.36,49.12 87.23,45.78 57.99,30.25 56.09,41.05 61.69,41.5 70.29,28.4 73.19,35.03 73.48,38.55 80.87,39.42 71.42,44.64 71.38,37.29 75.62,29.36 96.1,22.91 78.4,28.35 94.7,19.27 94.36,7.64 91.23,13.79 87.36,13.94 95.53,5.02 82.77,4.36 77.78,7.6 82.2,6.94 77.65,0.73 83.75,16.63 84.58,5.83 71.82,1.69 69.09,3.2 63.3,1.18 56,7.99 58.83,15.46 56.33,14.15 71.32,20.54 84.34,3.94 61.04,26.15 63.99,24.7 63.59,21.5 67.79,18.7 75.63,13.05 79.33,12.3 81.73,21 87.48,22.55 90.23,22.95 92.23,30.45 93.03,28.95 88.83,34.25 87.03,30.75 81.98,29.45 84.88,28.1 85.18,30.65 86.83,27.75 85.08,23.55 98.8,30.56 103.55,37.16 99.25,18.76 103.95,18.91 100.1,9.21 88.8,11.31 44.86,37.09 45.86,33.59 38.36,37.59 36.36,47.09 38.86,48.09 31.36,47.59 23.86,47.59 22.86,45.09 22.86,38.59 23.36,35.09 24.86,33.09 22.86,33.09 29.36,36.09 32.86,35.09 35.36,39.59 29.36,33.59 28.36,37.09 31.36,29.09 34.36,27.09 30.36,26.59 32.36,24.59 33.36,21.59 36.86,21.59 39.86,24.09 41.36,27.09 41.36,34.59 47.36,29.09 46.86,13.59 38.86,12.59 34.36,14.59 41.86,15.59 39.36,8.59 42.36,10.59 39.86,3.09 33.36,2.59 34.86,9.59 26.86,7.09 31.36,6.59 22.86,19.09 18.86,14.59 14.86,17.09 11.86,9.09 19.36,2.09 20.86,9.59 13.86,6.09 4.36,11.09 10.36,3.09 10.36,15.09 3.36,19.09 3.86,33.09 2.36,30.59 4.86,38.09 11.86,42.59 13.86,46.09 16.86,40.59 18.36,47.09 18.86,43.09 10.86,39.09 9.86,34.09 7.86,23.09 6.86,33.09 15.86,11.59 23.36,15.09 21.86,21.09 15.13,22.85 28.36,27.09 26.34,21.64 14.07,22.68 26.77,25.57 16.89,37.61 20.36,32.59 13.66,32.47 19.42,23.56 24.39,27.33 20.24,28.78 25.17,23.14 29.43,19.93 18.62,28.65
  pour Top: 54,50 107,50 107,-0.4 54,-0.4
  pour Bottom: 107,50 54,50 54,-0.2 107,-0.2
  pour Top: 0,50 50,50 50,0 0,0
  pour Bottom: 0,50 50,50 50,0 0,0
MISO  (via drill 0.3, 0.3 pad 0.4)
  Top 0.2: IC1.26 90.36,43.88 v90.34,43.89 | v74.3,35.4 SD1.7 74.31,32.07 R4.2 | v77.08,38.16 77.08,36.68 v76.91,36.51
  Bottom 0.2: v90.34,43.89 87.8,43.89 82.05,38.14 77.1,38.14 v77.08,38.16 | v76.91,36.51 76.88,36.54 74.71,36.54 74.3,36.13 v74.3,35.4
MOSI  (via drill 0.3, 0.3 pad 0.4)
  Top 0.2: IC1.25 90.46,43.07 v90.4,43.13 | SD1.3 69.91,34.66 v71.15,35.9
  Top 0.254: IC1.25
  Bottom 0.2: v90.4,43.13 87.87,43.13 85.12,40.38 84.84,40.38 81.98,37.53 72.85,37.53 71.22,35.9 v71.15,35.9
N$1
  Top 0.2: R3.1 88.13,41.58 89.03,42.48 IC1.17
N$2
  Top 0.2: R1.2 83.87,36.92 TR1.1
N$3
  Top 0.254: R25.1 U2.3
N$4
  Top 0.254: U3.3 R26.1
N$5
  Top 0.2: U1.12 16.5,23.6
  Top 0.254: 16.5,23.6 16.8,23.3 R13.1
N$6
  Top 0.254: U1.20 21.25,26.1 R16.1
N$7
  Top 0.305: U3.7 37.6,33.14 37.67,33.21
  Top 0.508: 38.25,33.65 L4.2 38.25,33.79 37.67,33.21
N$8
  Top 0.305: U3.9 36.6,33.18 36.55,33.23
  Top 0.508: 35.95,33.6 L4.1 35.95,33.83 36.55,33.23
N$9
  Top 0.305: U2.7 31.5,43.84 31.66,44
  Top 0.508: 32.2,44.59 L3.2 32.2,44.54 31.66,44
N$10  (via drill 0.35)
  Top 0.254: v10.75,19.45 LED1.K | v13.25,28.15 13.67,28.15 14.09,27.73 U1.1
  Bottom 0.254: v13.25,28.15 13.28,28.12 13.28,23.73 10.75,21.2 v10.75,19.45
N$11
  Top 0.305: U1.28 16.25,29.14 16.2,29.19
  Top 0.406: L2.2 15.2,35.1 15.8,34.5 C20.2 15.8,29.59 16.2,29.19
N$12
  Top 0.305: U1.26 17.15,28.8
  Top 0.406: L2.1 17.9,35.1 17.45,34.65 C19.1 17.45,29.6 17.15,29.3 17.15,28.8
N$13
  Top 0.406: 83.31,34.5 D1.A 83.36,32.71 82.89,32.24 BUZZ1.N 81.63,33.67 81.45,33.85 TR1.3
N$14  (via drill 0.3)
  Top 0.2: U1.4 15.45,26.5
  Top 0.254: C20.1 14.15,31 v14.1,30.95 | v15.55,26.4 15.45,26.5
  Bottom 0.254: v14.1,30.95 13.95,30.8 13.95,28 v15.55,26.4
N$15  (via drill 0.3)
  Top 0.254: C19.2 v19.25,31 | U1.19 18.06,25.7 17.96,25.8 v17.85,25.8
  Bottom 0.254: v19.25,31 19.5,30.75 19.5,28.59 19,28.09 19,26.95 v17.85,25.8
N$16  (via drill 0.35)
  Top 0.305: U1.29 15.8,28.72 15.67,28.85
  Top 0.406: v14.6,29.7 14.6,29.16
  Top 0.508: C28.1 C27.1 C25.1 14.6,29.16 15.36,29.16 15.67,28.85
  Bottom 0.305: C23.1 v14.6,29.7
N$17  (via drill 0.3)
  Top 0.254: U1.17 17.85,24.9 v17.75,25 | R14.1 R18.2 11.35,20 v11.4,19.95 | v16.17,22.38 16.17,21.48 14.65,19.95 v13.05,19.95
  Bottom 0.254: v17.75,25 17.75,23.95 v16.17,22.38 16.1,22.3 | v11.4,19.95 v13.05,19.95
N$18  (via drill 0.35)
  Top 0.254: U1.24 20.05,27.73 v20.11,27.67 | v30.02,20.85 29.53,21.34 FET1.4
  Bottom 0.254: v20.11,27.67 22.61,27.67 29.43,20.85 v30.02,20.85
N$19
  Top 0.305: U1.23 18.9,27.3 19.1,27.1 19.08,27.08 18.9,26.9 U1.22
  Top 0.508: 19.08,27.08 19.5,27.08 19.93,26.65 21.76,26.65 22.04,26.37 23.38,26.37 C24.1 C26.1 27.61,26.39 28.55,25.45 28.55,23.81
N$20
  Top 0.254: U1.18 C22.1 19.9,25.35 R19.2
N$21  (via drill 0.3)
  Top 0.254: R19.1 v20.8,23.6 | v27.65,19.95 28.2,19.95 28.25,19.9
  Top 0.508: FET1.1 27.58,20.93 28,20.5 28.25,20.5 | FET1.3 28.88,20.88 28.5,20.5 | 28.5,20.5 28.25,20.5 | FET1.2 28.22,20.77 28.5,20.5 | CN3.P$1 28.8,18.7 28.25,19.25 28.25,19.9 28.25,20.5
  Bottom 0.254: v20.8,23.6 23.28,23.6 26.93,19.95 v27.65,19.95
N$22  (via drill 0.3)
  Top 0.254: U1.16 18.13,23.92 19.35,22.7 v19.35,21.55 19.35,20.74 R17.1 R15.1 | v15.5,21.8 15.35,21.8 14.15,20.6 R20.2
  Bottom 0.254: v19.35,21.55 19.23,21.67 15.63,21.67 v15.5,21.8
N$23
  Top 0.254: R12.2 LED1.A
N$24
  Top 0.254: U3.4 37.6,29.25 38.1,28.75 R24.1
N$25
  Top 0.254: U3.5 38.1,29.55 39.1,28.55 R22.1
N$26
  Top 0.254: U1.8 15.3,24.9 | 15.3,24.9 15.5,24.9 16.15,25.55 16.15,26.7 15.8,27.05 15.3,27.05 15.15,26.9 U1.3 | U1.9 15.29,24.89 15.3,24.9
  Top 0.305: U1.2 14.55,27.3 14.35,27.1 14.55,26.9 U1.3
  Top 0.508: C16.2 13.13,26.89 13.34,27.1 14.35,27.1 | C16.2 C18.1 C17.1 7.11,26.89 6.5,27.5 CN2.P$1 | C16.2
N$27
  Top 0.305: U2.9 30.5,43.92 30.4,44.02
  Top 0.508: 29.9,44.45 L3.1 29.9,44.52 30.4,44.02
N$28
  Top 0.305: R7.2 74,3.25 C12.1 74.05,3.85 74.2,4 IC6.1
N$29
  Top 0.254: U2.4 31.5,40.4 31.95,39.95 R23.1
N$30
  Top 0.254: U2.5 32,40.55 32.85,39.7 R21.1
N$51
  Top 0.2: IC1.21 L1.2
N$53
  Top 0.2: IC7.2 58.15,13.1 59.1,14.05 61,14.05 61.45,13.6 61.45,10.7 61.65,10.5 IC8.8
N$55
  Top 0.2: IC8.2 63.7,8.8 63.4,8.5 61.55,8.5 61.05,9 61.05,13.05 60.55,13.55 59.5,13.55 58.95,13 IC7.1
N$61
  Top 0.2: IC1.2 92.47,42.48 92.85,42.1 92.85,39.8 L1.1
N$63
  Top 0.2: IC1.12 IC1.11
NRST  (via drill 0.3)
  Top 0.2: IC1.6 92.83,44.88 v92.85,44.9 | v92.83,46.64 92.33,47.14 89.22,47.14 v88.62,46.54 | R2.2 C2.1 | C2.1 | CON1.1 85.59,45.86 C2.1
  Bottom 0.2: v92.85,44.9 92.85,46.62 v92.83,46.64 | v88.62,46.54 86.22,46.54 CON1.1
REGN  (via drill 0.3)
  Top 0.254: 13.18,25.91 C21.1 13.37,26.1 v13.91,26.1 U1.5 | R20.1 v12.95,21.7 12.9,21.75 R12.1 R18.1
  Bottom 0.254: v13.91,26.1 13.91,23.56 12.95,22.6 v12.95,21.7
RST_N  (via drill 0.3 pad 0.4)
  Top 0.2: IC1.22 91.06,43.04
  Top 0.254: 91.06,43.04 v91.17,43.15
  Bottom 0.2: v91.17,43.15 91.17,40.43 89.99,39.25 86.64,39.25
SCL  (via drill 0.3)
  Top 0.2: IC1.8 93.41,46.08 95.76,43.72 v95.76,41.62 | v94.38,37.19 94.35,37.22 93.33,37.22 91.88,35.77 91.88,35.12 92.69,34.31 R5.2 93.05,32.81 IC2.2
  Bottom 0.2: v94.38,37.19 94.38,37.84 95.76,39.22 v95.76,41.62
SCL1  (via drill 0.3)  (1 unrouted)
  Top 0.2: IC8.1 61.88,9.47 v61.85,9.5 | v70.3,10.25 70.2,10.15 IC5.4 | IC6.6 74.2,7.9 73.67,8.43 v73.67,10.27 73.69,10.25 v80.75,10.25 IC4.5 | IC2.7 93.03,25.61 v93.2,25.43 93.2,24.69 R8.2 | IC3.P3 90.8,1.8 90.25,2.35 90.25,6.3 88.7,7.85 v88.7,7.9 | v93.2,20.35 93.2,12.45 v91.9,11.15 | v63.3,16.85 63.25,16.9 IC9.6 | CON2.4 57.05,26.76 57.05,31.05 57.96,31.96 IC10.4 61.64,31.96 62.6,31 62.6,28.05 63.65,27 67.5,27 67.9,26.6 67.9,25.6 v68.1,25.4 | v65.85,8.35 64.2,8.35 63.7,7.85 v61.9,7.85 | U1.14 17.3,23.4
  Top 0.254: v17.4,22.55 17.3,22.65 17.3,23.4 | v41.85,20.05 R11.2 | v31.72,18.43 37.79,18.43 v37.86,18.5
  Bottom 0.2: 73.69,10.25 v73.67,10.27 73.65,10.25 v70.3,10.25 66.6,10.25 | 66.6,10.25 65.85,9.5 v65.85,8.35 | v80.75,10.25 83.1,7.9 v88.7,7.9 91.9,11.1 v91.9,11.15 | v93.2,25.43 v93.2,20.35 | CON2.4 58.8,25.81 60.05,24.56 60.05,22.1 63.3,18.85 v63.3,16.85 63.95,16.85 66.3,14.5 66.3,10.55 66.6,10.25 | CN1.P$4 71.1,24.45 70.15,25.4 v68.1,25.4 | v61.85,9.5 61.85,7.9 v61.9,7.85
  Bottom 0.254: v17.4,22.55 17.55,22.4 22.65,22.4 26.62,18.43 v31.72,18.43 | CON3.4 44.16,25.81 41.85,23.5 v41.85,20.05 40.3,18.5 v37.86,18.5
SDA  (via drill 0.3)
  Top 0.2: IC1.7 93.36,45.48 95.15,43.68 v95.15,42.22 | v93.78,36.61 93.78,36.52 93.05,35.79 R6.2 v92.45,35.4 | v91.75,33.8 IC2.3
  Bottom 0.2: v95.15,42.22 v95.14,42.21 95.14,39.4 93.78,38.04 v93.78,36.61 | v92.45,35.4 91.75,34.7 v91.75,33.8
SDA1  (via drill 0.3)  (1 unrouted)
  Top 0.2: IC5.3 v69.4,9.65 | IC6.3 v76.6,4.7 | 64.95,11.62 IC8.5 65.67,11.53 v65.7,11.5 65.72,11.53 66.47,11.53 67.15,10.85 v67.15,9.65 | IC4.8 79.25,7.68 v79.28,7.71 | IC2.6 91.75,24.18 92.45,23.48 v92.57,23.48 93.24,23.48 R9.2 | IC3.P4 92.2,20.2 92.65,19.75 92.65,12.75 v91.95,12.05 | v79.25,9.6 v76.6,9.6 | IC9.5 63.97,16.61 63.42,16.05 63.05,16.05 v63.02,16.07 | v67.2,26.35 63.52,26.35 IC10.5
  Top 0.254: U1.15 17.7,23.5 v18.1,23.1 | CON3.2 46.98,20.75 R10.2 43,19.7 42.55,19.25 41.2,19.25 v40.7,19.75 | v37.27,19.13 37.25,19.15 v32.4,19.15
  Bottom 0.2: v67.15,9.65 v69.4,9.65 69.45,9.6 v76.6,9.6 v76.6,4.7 | v91.95,12.05 92.5,11.5 92.5,10.85 88.95,7.3 83.12,7.3 80.77,9.65 79.3,9.65 v79.25,9.6 79.25,7.74 v79.28,7.71 | v92.57,23.48 92.57,22.02 91.5,20.95 IC3.P4 | IC10.5 56.47,29.42 55.7,28.65 55.7,21.45 56.42,20.73 CON2.2 58.03,20.7 60.75,20.7 62.73,18.73 62.73,16.38 v63.02,16.07 63.83,16.07 65.7,14.2 v65.7,11.5 | CN1.P$2 75.1,25.3 74.05,26.35 v67.2,26.35
  Bottom 0.254: v18.1,23.1 18.25,22.95 23,22.95 26.8,19.15 v32.4,19.15 | v40.7,19.75 40.08,19.13 v37.27,19.13
SW1  (via drill 0.3, 0.3 pad 0.4, 0.45)
  Top 0.2: IC1.10 90.38,46.5 v90.35,46.53 | v93.85,46.49 95.56,46.49 v96.18,45.87
  Bottom 0.2: v90.35,46.53 90.35,46.86 90.69,47.2 93.22,47.2 93.85,46.57 v93.85,46.49 | SW1.3 SW1.4 101.55,40.95 100,40.95 96.68,44.27 96.68,45.37 v96.18,45.87
SW2  (via drill 0.3, 0.3 pad 0.4)
  Top 0.2: IC1.23 91.13,44.65 v91.16,44.65 | v99.29,38.68 100.25,37.72 100.25,31.55 v100.58,31.22 | v100.75,22.86 100.85,22.76 100.85,19.45 102.25,18.05 SW3.4 SW3.3
  Bottom 0.2: v91.16,44.65 91.72,44.65 91.85,44.52 91.85,43.83 92.27,43.41 94.85,43.41 96.39,41.87 97.83,41.87 99.29,40.41 v99.29,38.68 | v100.58,31.22 100.78,31.02 100.78,22.89 v100.75,22.86
SWCLK  (via drill 0.3)
  Top 0.2: IC1.15 88.44,43.67 86.03,41.27 82.4,41.27 v81.87,41.8
  Bottom 0.2: CON1.5 80.48,43.19 v81.87,41.8
SWDIO  (via drill 0.3)
  Top 0.2: IC1.14 88.41,44.27 86.02,41.88 83.27,41.88 v83.24,41.85
  Bottom 0.2: CON1.3 83.24,45.66 v83.24,41.85
SWT  (via drill 0.3, 0.3 pad 0.4)
  Top 0.2: IC1.24 90.37,45.09 v90.37,44.66 | v100.03,40.3 100.03,38.9 100.85,38.08 100.85,32.18 v100.89,32.14
  Bottom 0.2: SW2.3 SW2.4 102.25,30.78 v100.89,32.14 | v90.37,44.66 90.37,44.8 90.81,45.24 91.88,45.24 92.22,44.9 92.22,44.07 92.48,43.81 95.09,43.81 96.59,42.31 98.01,42.31 v100.03,40.3
SYS_POW  (via drill 0.3, 0.35)
  Top 0.254: U3.1 36.1,29.35 35.95,29.2 | 35.95,29.2 v35.9,29.2 | v32.95,32.15 32.95,32.74 | U3.2 36.6,29.4 36.4,29.2 35.95,29.2 | U2.1 30,40.4 29.65,40.05 | 29.65,40.05 v29.55,40.05 | v27,40.05 26.95,40 26.5,40 | U2.2 30.5,40.25 30.3,40.05 29.65,40.05
  Top 0.305: U1.25 17.6,28.57 17.77,28.74 17.77,28.86 | U3.10 35.95,32.45 | U2.10 29.85,43.15
  Top 0.508: C32.1 C33.1 C31.1 C30.1 20.79,30.54 20.51,30.26 18.85,30.26 | C32.1 C34.1 29.7,32 30.45,32.75 32.94,32.75 32.95,32.74 C36.1 35.11,32.74 35.4,32.45 35.95,32.45 | 18.85,30.26 18.52,30.26 18.19,29.93 18.19,29.28 17.77,28.86 | 29.85,43.15 29.59,43.15 29.1,43.64 C35.1 26.94,43.64 26.5,43.2 26.5,40 26.5,34 27.7,32.8 C32.1 | v18.85,29.75 18.85,30.26
  Bottom 0.254: v35.9,29.2 35.8,29.1 33.8,29.1 32.95,29.95 v32.95,32.15 | v29.55,40.05 v27,40.05
  Bottom 0.406: C29.1 18.25,29.75 v18.85,29.75

### Text on the board
tPlace: Solar LiFePO4 Pow V1.0 | + | G | + | + | + | Solar | G | G | LiFePO4 | + | https://dddev.group/
bPlace: https://dddev.group/ | Env Sensor Indoor V1.0